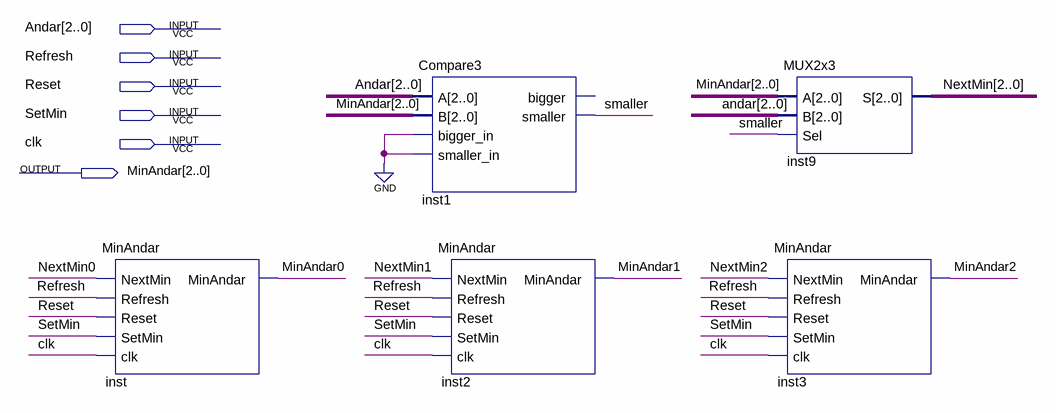
[diagram p0: schematic sheet]
// Quartus schematic MinAndar3.bdf as structural Verilog: 5 symbols, 6 pins
module MinAndar3 (
  input  [2:0] Andar,
  input  Refresh,
  input  Reset,
  input  SetMin,
  input  clk,
  output [2:0] MinAndar
);

  wire smaller;
  wire [2:0] NextMin;

  MinAndar inst (
    .NextMin(NextMin[0]), .Refresh(Refresh), .Reset(Reset), .SetMin(SetMin), .clk(clk), .MinAndar(MinAndar[0]));
  Compare3 inst1 (.A(Andar), .B(MinAndar), .bigger_in(1'b0), .smaller_in(1'b0), .smaller(smaller));  // open: bigger
  MinAndar inst2 (
    .NextMin(NextMin[1]), .Refresh(Refresh), .Reset(Reset), .SetMin(SetMin), .clk(clk), .MinAndar(MinAndar[1]));
  MUX2x3 inst9 (.A(MinAndar), .B(Andar), .Sel(smaller), .S(NextMin));
  MinAndar inst3 (
    .NextMin(NextMin[2]), .Refresh(Refresh), .Reset(Reset), .SetMin(SetMin), .clk(clk), .MinAndar(MinAndar[2]));
endmodule
